# EasyEDA Pro project ProPrj_ProDoc_Board_AI8051U_20240829A_2024-08-30.epro, schematic Schematic_20240829A, sheets 1 to 2 of 6

## Sheets
1 P1: Board Name: Board_20240829A; Drawed: www.STCAI.com; Reviewed: RHYS; Version: V1.2.2
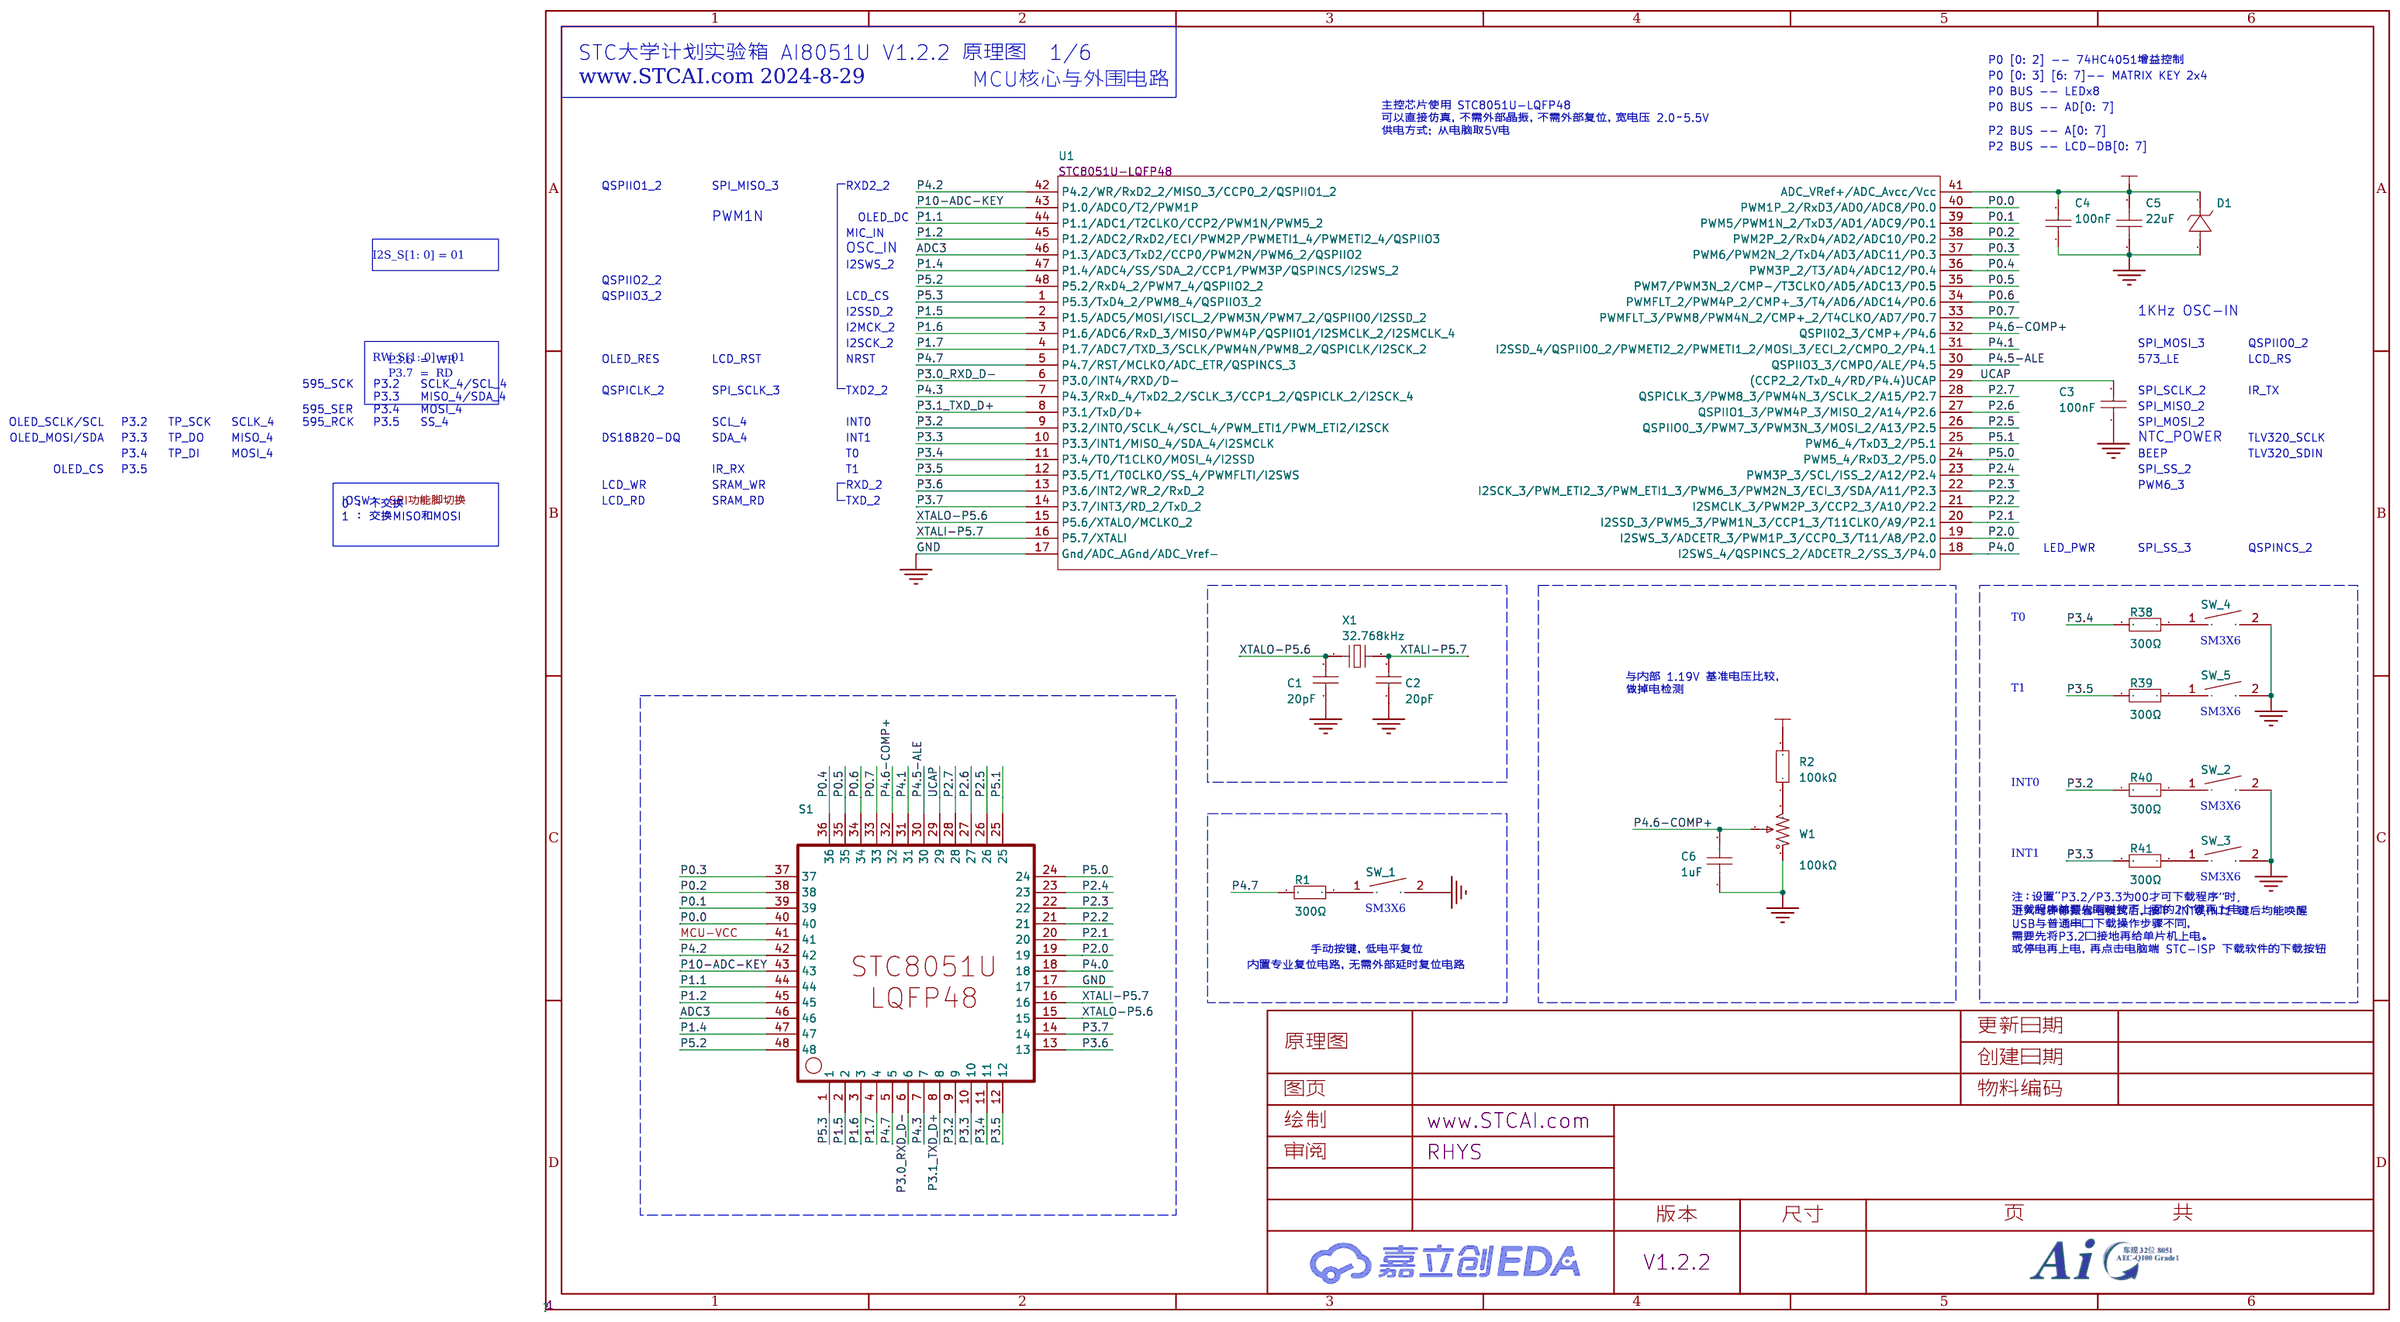
[diagram p0: P1]
2 P2
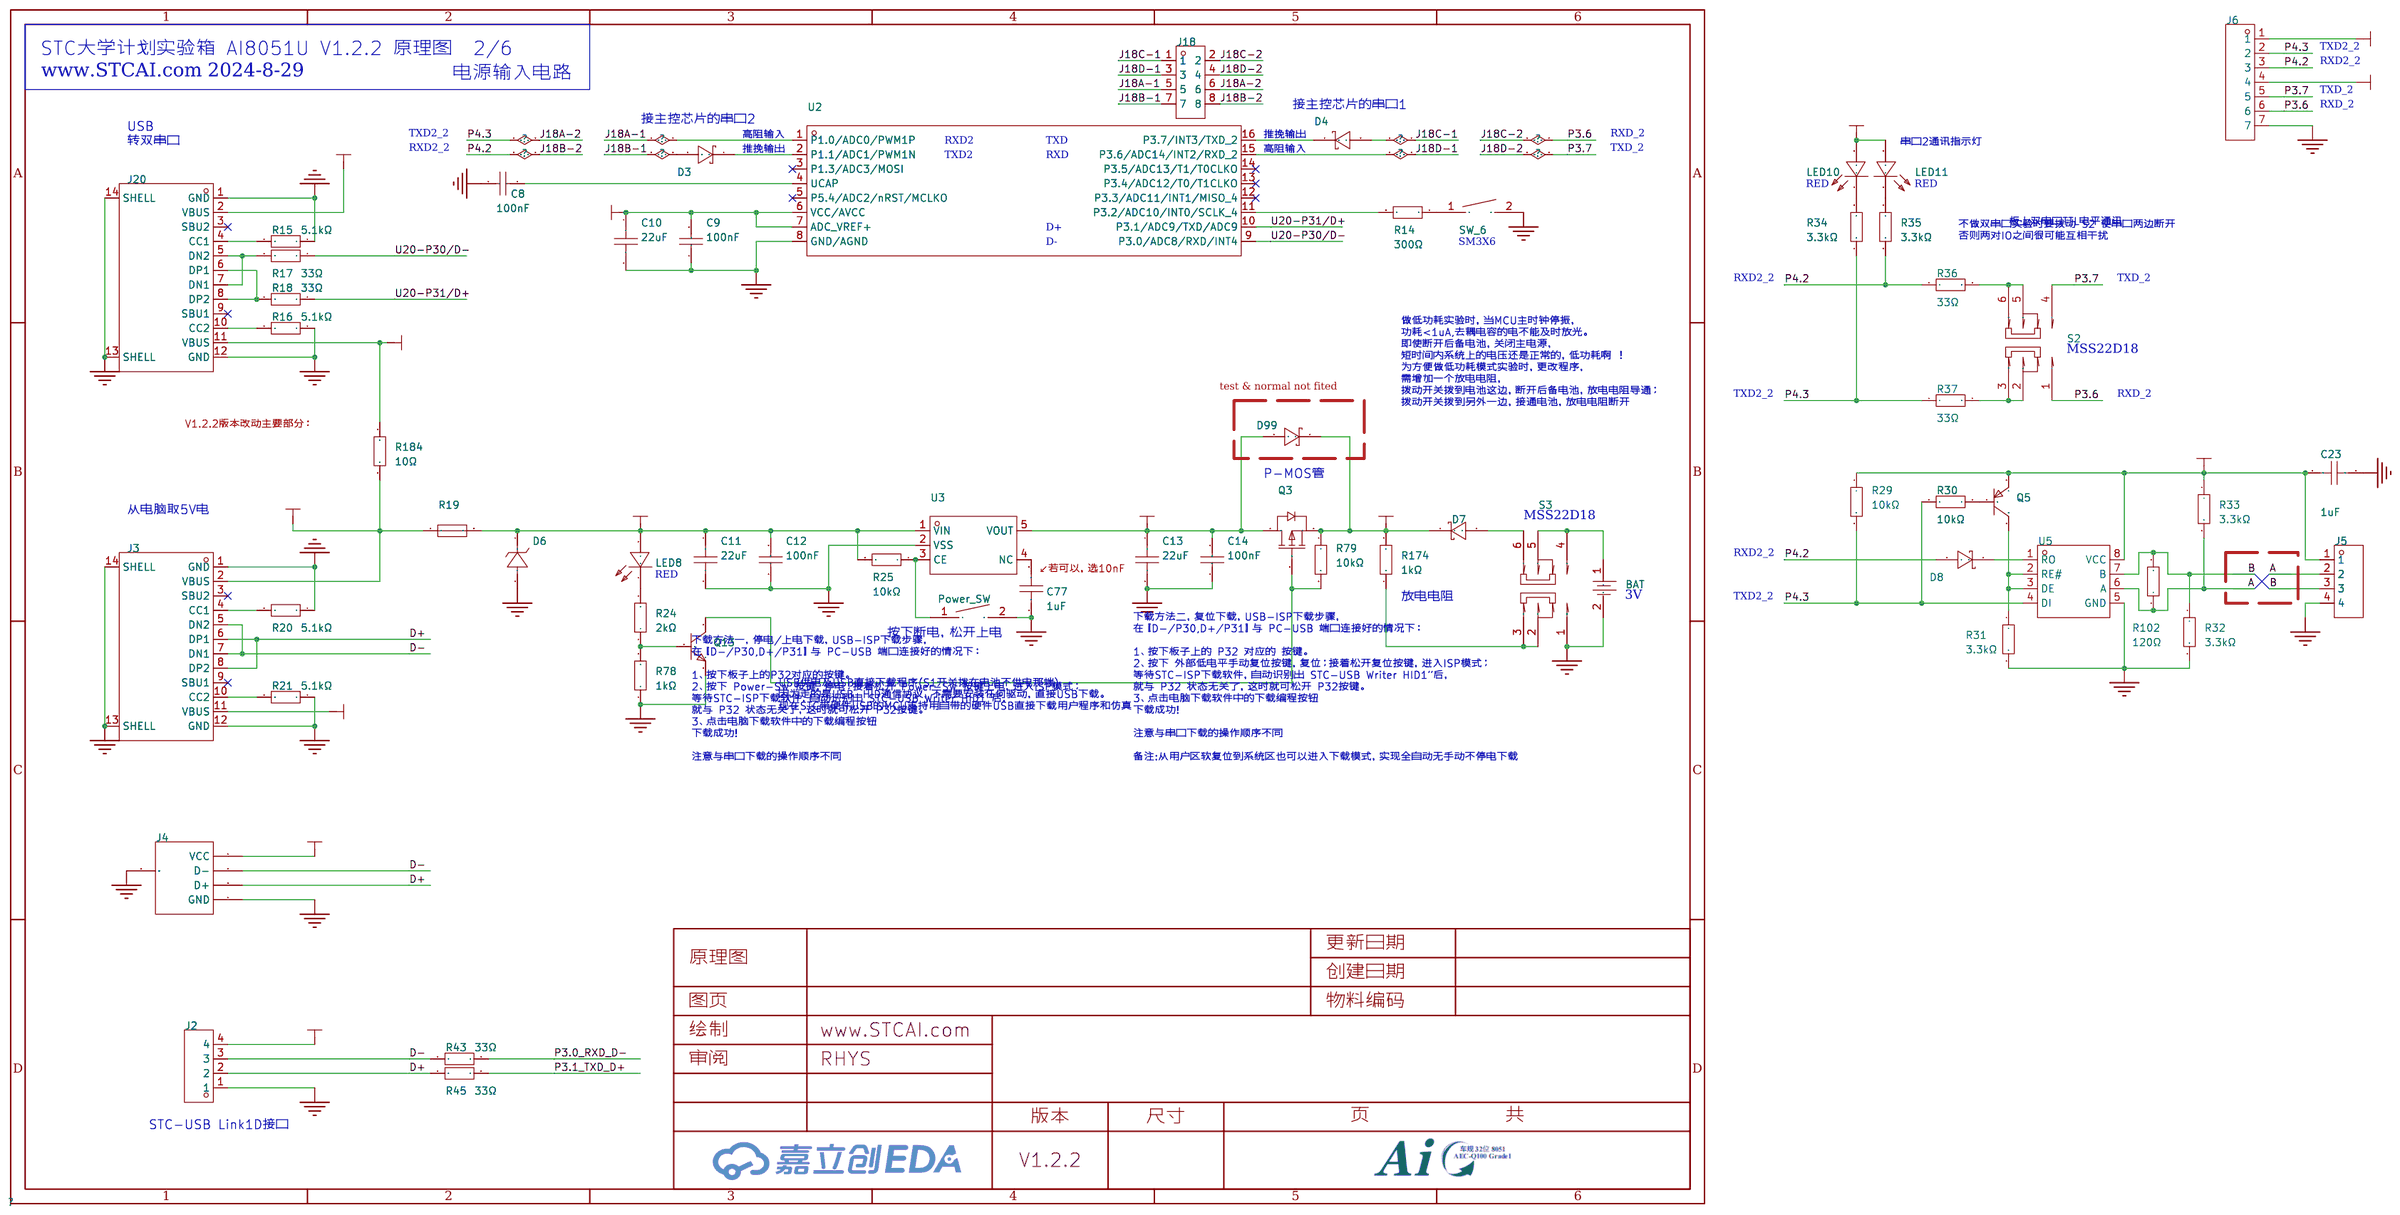
[diagram p1: P2]

## Parts
sheet P1
C1  20pF  [C0603]
C2  20pF  [C0603]
C3  100nF  [C0603]
C4  100nF  [C0603]
C5  22uF  [C0603]
C6  1uF  [C0603]
D1  SMBJ5338B  [SMB_L4.6-W3.6-LS5.4-RD]
R1  300Ω  [R0603]
R2  100kΩ  [R0603]
R38  300Ω  [R0603]
R39  300Ω  [R0603]
R40  300Ω  [R0603]
R41  300Ω  [R0603]
S1  -  [FP_LQFP-48-MiniCore]
SW_1  TSA363G25-250B  [SW-SMD_L6.1-W3.6-LS8.0]
SW_2  TSA363G25-250B  [SW-SMD_L6.1-W3.6-LS8.0]
SW_3  TSA363G25-250B  [SW-SMD_L6.1-W3.6-LS8.0]
SW_4  TSA363G25-250B  [SW-SMD_L6.1-W3.6-LS8.0]
SW_5  TSA363G25-250B  [SW-SMD_L6.1-W3.6-LS8.0]
U1  STC8051U  [LQFP-48_48P-L7.0-W7.0-P0.50-LS9.0-BL]
W1  100kΩ  [RES-ADJ-TH_3362P]
X1  32.768kHz  [OSC-SMD_L3.2-W1.5]
sheet P2
BAT  KH-CR1220-2  [BAT-SMD_CR1220-2]
C8  100nF  [C0603]
C9  100nF  [C0603]
C10  22uF  [C0603]
C11  22uF  [C0603]
C12  100nF  [C0603]
C13  22uF  [C0603]
C14  100nF  [C0603]
C23  1uF  [C0603]
C77  1uF  [C0603]
D3  1N5817WS  [SOD-323_L1.8-W1.3-LS2.5-RD]
D4  1N5817WS  [SOD-323_L1.8-W1.3-LS2.5-RD]
D6  SMBJ5338B  [SMB_L4.6-W3.6-LS5.4-RD]
D7  1N5817WS  [SOD-323_L1.8-W1.3-LS2.5-RD]
D8  1N5817WS  [SOD-323_L1.8-W1.3-LS2.5-RD]
D99  1N5817WS  [SOD-323_L1.8-W1.3-LS2.5-RD]
J2  BX-XH2.54-4PZZ  [CONN-TH_4P-P2.50_BX-XH2.54-4PZZ]
J3  TYPE-C 16PIN 2MD(073)  [USB-C-SMD_TYPE-C-6PIN-2MD-073]
J4  AF 90° WJDG  [USB-A-TH_AF-WJDG]
J5  BX-XH2.54-4PZZ  [CONN-TH_4P-P2.50_BX-XH2.54-4PZZ]
J6  BX-HA2.54-7PZZ  [CONN-TH_7P-P2.50_BX-HA2.54-7PZZ]
J18  2.54-2*4P立贴针  [HDR-SMD_8P-P2.54-V-M-R2-C4-LS7.4]
J20  TYPE-C 16PIN 2MD(073)  [USB-C-SMD_TYPE-C-6PIN-2MD-073]
LED8  KT-0603R  [LED0603-RD]
LED10  KT-0603R  [LED0603-RD]
LED11  KT-0603R  [LED0603-RD]
Power_SW  TSA363G25-250B  [SW-SMD_L6.1-W3.6-LS8.0]
Q3  AO3401A  [SOT-23_L2.9-W1.3-P1.90-LS2.4-BR]
Q5  SS8550 Y2  [SOT-23-3_L2.9-W1.3-P1.90-LS2.4-BR]
Q13  SS8050  [SOT-23-3_L2.9-W1.3-P1.90-LS2.4-BR]
R14  300Ω  [R0603]
R15  5.1kΩ  [R0603]
R16  5.1kΩ  [R0603]
R17  33Ω  [R0603]
R18  33Ω  [R0603]
R19  SMD0805B050TF  [F0805]
R20  5.1kΩ  [R0603]
R21  5.1kΩ  [R0603]
R24  2kΩ  [R0603]
R25  10kΩ  [R0603]
R29  10kΩ  [R0603]
R30  10kΩ  [R0603]
R31  3.3kΩ  [R0603]
R32  3.3kΩ  [R0603]
R33  3.3kΩ  [R0603]
R34  3.3kΩ  [R0603]
R35  3.3kΩ  [R0603]
R36  33Ω  [R0603]
R37  33Ω  [R0603]
R43  33Ω  [R0603]
R45  33Ω  [R0603]
R78  1kΩ  [R0603]
R79  10kΩ  [R0603]
R102  120Ω  [R0603]
R174  1kΩ  [R0603]
R184  10Ω  [R0603]
S2  SS-3235S-L1  [SW-SMD_SS-3235S-LX]
S3  SS-3235S-L1  [SW-SMD_SS-3235S-LX]
SW_6  TSA363G25-250B  [SW-SMD_L6.1-W3.6-LS8.0]
U2  STC8H2K12U-45I-SOP16  [SOP-16_L9.9-W3.9-P1.27-LS6.0-BL]
U3  ME6213C33M5G  [SOT-23-5_L3.0-W1.7-P0.95-LS2.8-BR]
U5  SP3485EN-L/TR  [SOIC-8_L5.0-W4.0-P1.27-LS6.0-BL]

## Library data of the parts
C1 C2 = CC0603JRNPO9BN200: 容值:20pF;精度:±5%;额定电压:50V;材质(温度系数):NP0;; LCSC Part Name: 20pF ±5% 50V; Supplier Part: C105621; Manufacturer: YAGEO(国巨); Supplier Footprint: 0603; JLCPCB Part Class: 扩展库; Datasheet: https://atta.szlcsc.com/upload/public/pdf/source/20170505/1493957838062.pdf; Supplier: LCSC; Tolerance: ±5%; Voltage Rated: 50V; Temperature Coefficient: NP0
C3 C4 C8 C9 C12 C14 = CL10B104KO8NNNC: 容值:100nF;精度:±10%;额定电压:16V;材质(温度系数):X7R;; LCSC Part Name: 100nF ±10% 16V; Supplier Part: C66501; Manufacturer: SAMSUNG(三星); Supplier Footprint: 0603; JLCPCB Part Class: 扩展库; Datasheet: https://atta.szlcsc.com/upload/public/pdf/source/20160218/1457707763339.pdf; Supplier: LCSC; Tolerance: ±10%; Voltage Rated: 16V; Temperature Coefficient: X7R
C5 C10 C11 C13 = CL10A226MO7JZNC: 容值:22uF;精度:±20%;额定电压:16V;材质(温度系数):X5R;; LCSC Part Name: 22uF ±20% 16V; Supplier Part: C2762594; Manufacturer: SAMSUNG(三星); Supplier Footprint: 0603; JLCPCB Part Class: 扩展库; Datasheet: https://atta.szlcsc.com/upload/public/pdf/source/20220811/0832C3B1C642040B023B7A6186895861.pdf; Supplier: LCSC; Tolerance: ±20%; Voltage Rated: 16V; Temperature Coefficient: X5R
C6 C23 C77 = CL10A105KB8NNNC: 容值:1uF;精度:±10%;额定电压:50V;材质(温度系数):X5R;; LCSC Part Name: 1uF ±10% 50V; Supplier Part: C15849; Manufacturer: SAMSUNG(三星); Supplier Footprint: 0603; Datasheet: https://atta.szlcsc.com/upload/public/pdf/source/20160218/1457707763339.pdf; Supplier: LCSC; Tolerance: ±10%; Voltage Rated: 50V; Temperature Coefficient: X5R
D1 D6 = SMBJ5338B_C19077493: 二极管配置:独立式;稳压值(标称值):5.1V;稳压值(范围):4.85V~5.36V;功率:5W;; Supplier Part: C19077493; Manufacturer: 宏迦橙; Supplier Footprint: SMB; Datasheet: https://atta.szlcsc.com/upload/public/pdf/source/20231024/356C06B1F951B7783177D5E20F04BB62.pdf; Supplier: LCSC; Diode Configuration: 独立式; Zener Voltage (Nom): 5.1V; Reverse Leakage Current (Ir): 1uA@1V; Zener Voltage (Range): 4.85V~5.36V; Power Dissipation: 5W; Zener Impedance (Zzt): 1.5Ω
R1 R14 R38-R41 = 0603WAF3000T5E: 电阻类型:厚膜电阻;阻值:300Ω;精度:±1%;功率:100mW;最大工作电压:75V;温度系数:±100ppm/℃;; LCSC Part Name: 300Ω ±1% 100mW 厚膜电阻; Supplier Part: C23025; Manufacturer: UNI-ROYAL(厚声); Supplier Footprint: 0603; JLCPCB Part Class: 基础库; Datasheet: https://atta.szlcsc.com/upload/public/pdf/source/20200306/C422600_1E6D84923E4A46A82E41ADD87F860B5C.pdf; Supplier: LCSC; Type: 厚膜电阻; Tolerance: ±1%; Power(Watts): 100mW; Overload Voltage (Max): 75V; Temperature Coefficient: ±100ppm/℃; Operating Temperature Range: -55℃~+155℃
R2 = 0603WAF1003T5E: 电阻类型:厚膜电阻;阻值:100kΩ;精度:±1%;功率:100mW;最大工作电压:75V;温度系数:±100ppm/℃;; LCSC Part Name: 100kΩ ±1% 100mW 厚膜电阻; Supplier Part: C25803; Manufacturer: UNI-ROYAL(厚声); Supplier Footprint: 0603; JLCPCB Part Class: 基础库; Datasheet: https://atta.szlcsc.com/upload/public/pdf/source/20200306/C422600_1E6D84923E4A46A82E41ADD87F860B5C.pdf; Supplier: LCSC; Type: 厚膜电阻; Tolerance: ±1%; Power(Watts): 100mW; Overload Voltage (Max): 75V; Temperature Coefficient: ±100ppm/℃; Operating Temperature Range: -55℃~+155℃
S1 = LQFP48-MiniCore
Power_SW SW_1-SW_6 = TSA363G25-250B: 电路结构:单刀单掷;按钮形状:矩形按钮;作用力:250gf;安装方式:立贴;开关长度:6.05mm;开关宽度:3.6mm;开关高度:2.5mm;带支架:不带;触点电流:50mA;额定电压(DC):12V;绝缘电阻:100MΩ;带灯:无;机械寿命:5万次;; LCSC Part Name: 6.05*3.6*2.5mm 立贴 轻触开关; Supplier Part: C354943; Manufacturer: BRIGHT(博瑞泰); Supplier Footprint: SMD; JLCPCB Part Class: 扩展库; Datasheet: https://atta.szlcsc.com/upload/public/pdf/source/20190426/C354943_F8D02988919B0D3B4D493E3C3D798834.pdf; Supplier: LCSC; Circuit: 单刀单掷; Actuator Style: 矩形按钮; Operating Force: 250gf; Mounting Style: 立贴; Switch Length: 6.05mm; Switch Width: 3.6mm; Switch Height: 2.5mm; Strike Gundam: 不带; Contact Current: 50mA; Voltage Rating (DC): 12V; Insulation Resistance: 100MΩ; Actuator/Cap Color: 白色; With Lamp: 无; Pin Style: 鸥翼型; Mechanical Life: 5万次; Operating Temperature: -25℃~+70℃
U1 = STC8051U: STC8051U-LQFP48
W1 = 3362P-1-104: 阻值:100kΩ;精度:±10%;; LCSC Part Name: 100kΩ ±10%; Supplier Part: C118966; Manufacturer: BOCHEN(博晨); Supplier Footprint: 插件; JLCPCB Part Class: 扩展库; Datasheet: https://atta.szlcsc.com/upload/public/pdf/source/20171114/C118966_15106326666201117452.pdf; Supplier: LCSC; Tolerance: ±10%
X1 = X321532768KGD2SI: 晶振类型:贴片晶振;频率:32.768kHz;常温频差:±20ppm;外接负载电容:12.5pF;频率稳定度(全温):-;; LCSC Part Name: 32.768kHz ±20ppm 12.5pF; Supplier Part: C620155; Manufacturer: YXC(扬兴晶振); Supplier Footprint: SMD3215-2P; JLCPCB Part Class: 扩展库; Datasheet: https://atta.szlcsc.com/upload/public/pdf/source/20240329/3A7650FD985DD0DE85694D3785AB4916.pdf; Supplier: LCSC; Crystal Type: 贴片晶振; Normal temperature Frequency Tolerance: ±20ppm; External load capacitor: 12.5pF; Operating Temperature: -40℃~+85℃
BAT = KH-CR1220-2: PPS BS-1220-2贴片正负极带孔6号模; Supplier Part: C5365933; Manufacturer: kinghelm(金航标); JLCPCB Part Class: 扩展库; Datasheet: https://atta.szlcsc.com/upload/public/pdf/source/20230301/1E62885793E6CFB75C333AA3D0BD606A.pdf; Supplier: LCSC
D3 D4 D7 D8 D99 = 1N5817WS: 正向压降(Vf):750mV@3.1A;直流反向耐压(Vr):20V;平均整流电流(Io):1A;; LCSC Part Name: 电压:20V 电流:1A; Supplier Part: C489146; Manufacturer: KEXIN(科信); Supplier Footprint: SOD-323; JLCPCB Part Class: 扩展库; Datasheet: https://atta.szlcsc.com/upload/public/pdf/source/20200225/C489147_F0861A42A5EB259406EDAA7C68BCB597.pdf; Supplier: LCSC; Forward Voltage (Vf@If): 750mV@3.1A; Reverse Voltage (Vr): 20V; Average Rectified Current (Io): 1A
J2 J5 = BX-XH2.54-4PZZ: 插针结构:1x4P;间距:2.54mm;安装方式:直插;参考系列:XH;总PIN数:4P;排数:1;每排PIN数:4;行距:-;额定电流:3A;触头材质:黄铜;触头镀层:锡;工作温度范围:-25℃~+85℃;; Supplier Part: C18077835; Manufacturer: Bossie(博锡); Supplier Footprint: 插件,P=2.54mm; JLCPCB Part Class: 扩展库; Datasheet: https://atta.szlcsc.com/upload/public/pdf/source/20231017/5821079C87ACB6AB664C681F6F628D03.pdf; Supplier: LCSC; Pins Structure: 1x4P; Pitch: 2.54mm; Mounting Style: 直插; Reference Series: XH; Number of Pins: 4P; Number of Rows: 1; Number of PINs Per Row: 4; Current Rating (Max): 3A; Contact Material: 黄铜; Contact Plating: 锡; Operating Temperature Range: -25℃~+85℃
J3 J20 = TYPE-C 16PIN 2MD(073): 连接器类型:Type-C;标准:-;公母:母;端口数量:1;触点数量:16P;安装方式:卧贴;额定电流 - 电源:5A;工作温度范围:-25℃~+85℃;; LCSC Part Name: Type-C 母 卧贴; Supplier Part: C2765186; Manufacturer: SHOU HAN(首韩); Supplier Footprint: SMD; JLCPCB Part Class: 扩展库; Datasheet: https://atta.szlcsc.com/upload/public/pdf/source/20211123/39B17C16241EAC15C5E277BDA434118E.pdf; Supplier: LCSC; Connector Type: Type-C; Gender: 母; Number of Ports: 1; Number of Contacts: 16P; Mounting Style: 卧贴; Current Rating - Power (Max): 5A; Operating Temperature Range: -25℃~+85℃
J4 = AF 90° WJDG: 连接器类型:Type-A;标准:USB 2.0;公母:母;端口数量:1;触点数量:4P;安装方式:弯插;额定电流 - 电源:1.5A;工作温度范围:-25℃~+85℃;; LCSC Part Name: Type-A 母 弯插; Supplier Part: C456018; Manufacturer: SHOU HAN(首韩); Supplier Footprint: 插件; JLCPCB Part Class: 扩展库; Datasheet: https://atta.szlcsc.com/upload/public/pdf/source/20191113/C456018_B104E062BEB8E11E57E63560E04EE13A.pdf; Supplier: LCSC; Connector Type: Type-A; Standard: USB 2.0; Gender: 母; Number of Ports: 1; Number of Contacts: 4P; Mounting Style: 弯插; Current Rating - Power (Max): 1.5A; Operating Temperature Range: -25℃~+85℃
J6 = BX-HA2.54-7PZZ: 插针结构:1x7P;间距:2.54mm;安装方式:直插;参考系列:-;总PIN数:7P;排数:1;每排PIN数:7;行距:-;额定电流:3A;触头材质:黄铜;触头镀层:锡;工作温度范围:-25℃~+85℃;; LCSC Part Name: 1x7P 间距:2.54mm 直插; Supplier Part: C18077820; Manufacturer: Bossie(博锡); Supplier Footprint: 插件,P=2.54mm; Datasheet: https://atta.szlcsc.com/upload/public/pdf/source/20231017/A4DEDB2B134730F88A4902D1943B965C.pdf; Supplier: LCSC; Pins Structure: 1x7P; Pitch: 2.54mm; Mounting Style: 直插; Number of Pins: 7P; Number of Rows: 1; Number of PINs Per Row: 7; Current Rating (Max): 3A; Contact Material: 黄铜; Contact Plating: 锡; Operating Temperature Range: -25℃~+85℃
J18 = 2.54-2*4P立贴针: 插针结构:2x4P;间距:2.54mm;行距:2.54mm;圆针/方针:方针;安装类型:立贴;排数:双排;总PIN位数:8P;额定电流:3A;额定电压:-;配合针长度:6mm;塑高:2.5mm;端接针长度:-;触头材质:-;触头镀层:-;工作温度范围:-55℃~+105℃;颜色:黑色;; LCSC Part Name: 间距:2.54mm 2x4P 立贴 方针; Supplier Part: C192300; Manufacturer: BOOMELE(博穆精密); Supplier Footprint: SMD,P=2.54mm; JLCPCB Part Class: 扩展库; Datasheet: https://atta.szlcsc.com/upload/public/pdf/source/20210812/F9D0E068B6990BF98BEA9D68FBD6ED36.pdf; Supplier: LCSC; Pin Structure: 2x4P; Pitch: 2.54mm; Row Spacing: 2.54mm; Circluar Pins/Square Pins: 方针; Mounting Type: 立贴; Number of Rows: 双排; Number of Pins: 8P; Current Rating (Max): 3A; Length of Mating Pin: 6mm; Insulation Height: 2.5mm; Operating Temperature Range: -55℃~+105℃; Color: 黑色
LED8 LED10 LED11 = KT-0603R: 发光颜色:红色;功率:-;正向电流:-;主波长:-;二极管配置:-;透镜颜色:-;色温:-;发光角度:-;载带方式:-;工作温度:-40℃~+85℃;; LCSC Part Name: 0603 红灯 高亮; Supplier Part: C2286; Manufacturer: KENTO; Supplier Footprint: 0603; JLCPCB Part Class: 基础库; Datasheet: https://atta.szlcsc.com/upload/public/pdf/source/20160616/1466072038404.pdf; Supplier: LCSC; Emitted Color: 红色; Operating Temperature: -40℃~+85℃
Q3 = AO3401A_C15127: 类型:1个P沟道;漏源电压(Vdss):30V;连续漏极电流(Id):4A;功率(Pd):1.4W;导通电阻(RDS(on)@Vgs,Id):44mΩ@10V,4.3A;阈值电压(Vgs(th)@Id):1.3V@250uA;; LCSC Part Name: 1个P沟道 耐压:30V 电流:4A; Supplier Part: C15127; Manufacturer: AOS; Supplier Footprint: SOT-23; JLCPCB Part Class: 基础库; Datasheet: https://atta.szlcsc.com/upload/public/pdf/source/20160507/1462613609053.pdf; Supplier: LCSC; Type: 1个P沟道; Drain Source Voltage (Vdss): 30V; Continuous Drain Current (Id): 4A; Power Dissipation (Pd): 1.4W; Drain Source On Resistance (RDS(on)@Vgs,Id): 44mΩ@10V,4.3A; Gate Threshold Voltage (Vgs(th)@Id): 1.3V@250uA; Total Gate Charge (Qg@Vgs): 12.2nC@4.5V; Input Capacitance (Ciss@Vds): 1.2nF@15V; Operating Temperature: -55℃~+150℃@(Tj)
Q5 = SS8550 Y2: 晶体管类型:PNP;集电极电流(Ic):1.5A;集射极击穿电压(Vceo):25V;功率(Pd):300mW;直流电流增益(hFE@Ic,Vce):200@100mA,1V;; LCSC Part Name: SS8550 Y2(RANGE:200-350) hfe=200~350; Supplier Part: C8542; Manufacturer: CJ(江苏长电/长晶); Supplier Footprint: SOT-23; JLCPCB Part Class: 基础库; Datasheet: https://atta.szlcsc.com/upload/public/pdf/source/20140809/1457707214734.pdf; Supplier: LCSC; Transistor Type: PNP; Collector Current (Ic): 1.5A; Collector-Emitter Breakdown Voltage (Vceo): 25V; Power Dissipation (Pd): 300mW; DC Current Gain (hFE@Ic,Vce): 200@100mA,1V; Transition Frequency (fT): 100MHz; Collector Cut-Off Current (Icbo): 100nA; Collector-Emitter Saturation Voltage (VCE(sat)@Ic,Ib): 500mV@800mA,80mA
Q13 = SS8050_C2150: 晶体管类型:NPN;集电极电流(Ic):1.5A;集射极击穿电压(Vceo):25V;功率(Pd):300mW;直流电流增益(hFE@Ic,Vce):200@100mA,1V;; LCSC Part Name: SS8050(RANGE:200-350) hfe=200~350; Supplier Part: C2150; Manufacturer: CJ(江苏长电/长晶); Supplier Footprint: SOT-23; JLCPCB Part Class: 基础库; Datasheet: https://atta.szlcsc.com/upload/public/pdf/source/20230322/AEE86F4B043774EFF80CAEA14A37D9E9.pdf; Supplier: LCSC; Transistor Type: NPN; Collector Current (Ic): 1.5A; Collector-Emitter Breakdown Voltage (Vceo): 25V; Power Dissipation (Pd): 300mW; DC Current Gain (hFE@Ic,Vce): 200@100mA,1V; Transition Frequency (fT): 100MHz; Collector Cut-Off Current (Icbo): 100nA; Collector-Emitter Saturation Voltage (VCE(sat)@Ic,Ib): 500mV@800mA,80mA
R15 R16 R20 R21 = 0603WAF5101T5E: 电阻类型:厚膜电阻;阻值:5.1kΩ;精度:±1%;功率:100mW;最大工作电压:75V;温度系数:±100ppm/℃;; LCSC Part Name: 5.1kΩ ±1% 100mW 厚膜电阻; Supplier Part: C23186; Manufacturer: UNI-ROYAL(厚声); Supplier Footprint: 0603; Datasheet: https://atta.szlcsc.com/upload/public/pdf/source/20200306/C422600_1E6D84923E4A46A82E41ADD87F860B5C.pdf; Supplier: LCSC; Type: 厚膜电阻; Tolerance: ±1%; Power(Watts): 100mW; Overload Voltage (Max): 75V; Temperature Coefficient: ±100ppm/℃; Operating Temperature Range: -55℃~+155℃
R17 R18 R36 R37 R43 R45 = 0603WAF330JT5E: 电阻类型:厚膜电阻;阻值:33Ω;精度:±1%;功率:100mW;最大工作电压:75V;温度系数:±100ppm/℃;; LCSC Part Name: 33Ω ±1% 100mW 厚膜电阻; Supplier Part: C23140; Manufacturer: UNI-ROYAL(厚声); Supplier Footprint: 0603; Datasheet: https://atta.szlcsc.com/upload/public/pdf/source/20200306/C422600_1E6D84923E4A46A82E41ADD87F860B5C.pdf; Supplier: LCSC; Type: 厚膜电阻; Tolerance: ±1%; Power(Watts): 100mW; Overload Voltage (Max): 75V; Temperature Coefficient: ±100ppm/℃; Operating Temperature Range: -55℃~+155℃
R19 = SMD0805B050TF: 最大电压:6V;最大电流:100A;保持电流:500mA;跳闸电流:1A;; LCSC Part Name: 6V 500mA 0805自恢复; Supplier Part: C269104; Manufacturer: Brightking(君耀电子); Supplier Footprint: 0805; JLCPCB Part Class: 扩展库; Datasheet: https://atta.szlcsc.com/upload/public/pdf/source/20180913/C269107_1BF28CF6F4C5BFD5B8CD673BC8D2B923.pdf; Supplier: LCSC; Operating Voltage (Max): 6V; Current Rating (Max): 100A; Hold Current: 500mA; Trip Current: 1A; Resistance - Initial (Ri) (Min): 150mΩ; Maximum Time to Trip: 100ms; Operating Temperature: -40℃~+85℃；-40℃~+85℃；-40℃~+85℃
R24 = 0603WAF2001T5E: 电阻类型:厚膜电阻;阻值:2kΩ;精度:±1%;功率:100mW;最大工作电压:75V;温度系数:±100ppm/℃;; LCSC Part Name: 2kΩ ±1% 100mW 厚膜电阻; Supplier Part: C22975; Manufacturer: UNI-ROYAL(厚声); Supplier Footprint: 0603; JLCPCB Part Class: 基础库; Datasheet: https://atta.szlcsc.com/upload/public/pdf/source/20200306/C422600_1E6D84923E4A46A82E41ADD87F860B5C.pdf; Supplier: LCSC; Type: 厚膜电阻; Tolerance: ±1%; Power(Watts): 100mW; Overload Voltage (Max): 75V; Temperature Coefficient: ±100ppm/℃; Operating Temperature Range: -55℃~+155℃
R25 R29 R30 R79 = 0603WAF1002T5E: 电阻类型:厚膜电阻;阻值:10kΩ;精度:±1%;功率:100mW;最大工作电压:75V;温度系数:±100ppm/℃;; LCSC Part Name: 厚膜电阻 10kΩ ±1% 100mW; Supplier Part: C25804; Manufacturer: UNI-ROYAL(厚声); Supplier Footprint: 0603; JLCPCB Part Class: 基础库; Datasheet: https://atta.szlcsc.com/upload/public/pdf/source/20200306/C422600_1E6D84923E4A46A82E41ADD87F860B5C.pdf; Supplier: LCSC; Type: 厚膜电阻; Tolerance: ±1%; Power(Watts): 100mW; Overload Voltage (Max): 75V; Temperature Coefficient: ±100ppm/℃; Operating Temperature Range: -55℃~+155℃
R31-R35 = 0603WAF3301T5E: 电阻类型:厚膜电阻;阻值:3.3kΩ;精度:±1%;功率:100mW;最大工作电压:75V;温度系数:±100ppm/℃;; LCSC Part Name: 3.3kΩ ±1% 100mW 厚膜电阻; Supplier Part: C22978; Manufacturer: UNI-ROYAL(厚声); Supplier Footprint: 0603; JLCPCB Part Class: 基础库; Datasheet: https://atta.szlcsc.com/upload/public/pdf/source/20200306/C422600_1E6D84923E4A46A82E41ADD87F860B5C.pdf; Supplier: LCSC; Type: 厚膜电阻; Tolerance: ±1%; Power(Watts): 100mW; Overload Voltage (Max): 75V; Temperature Coefficient: ±100ppm/℃; Operating Temperature Range: -55℃~+155℃
R78 R174 = 0603WAF1001T5E: 电阻类型:厚膜电阻;阻值:1kΩ;精度:±1%;功率:100mW;最大工作电压:75V;温度系数:±100ppm/℃;; LCSC Part Name: 1kΩ ±1% 100mW 厚膜电阻; Supplier Part: C21190; Manufacturer: UNI-ROYAL(厚声); Supplier Footprint: 0603; JLCPCB Part Class: 基础库; Datasheet: https://atta.szlcsc.com/upload/public/pdf/source/20200306/C422600_1E6D84923E4A46A82E41ADD87F860B5C.pdf; Supplier: LCSC; Type: 厚膜电阻; Tolerance: ±1%; Power(Watts): 100mW; Overload Voltage (Max): 75V; Temperature Coefficient: ±100ppm/℃; Operating Temperature Range: -55℃~+155℃
R102 = 0603WAF1200T5E: 电阻类型:厚膜电阻;阻值:120Ω;精度:±1%;功率:100mW;最大工作电压:75V;温度系数:±100ppm/℃;; LCSC Part Name: 120Ω ±1% 100mW 厚膜电阻; Supplier Part: C22787; Manufacturer: UNI-ROYAL(厚声); Supplier Footprint: 0603; Datasheet: https://atta.szlcsc.com/upload/public/pdf/source/20200306/C422600_1E6D84923E4A46A82E41ADD87F860B5C.pdf; Supplier: LCSC; Type: 厚膜电阻; Tolerance: ±1%; Power(Watts): 100mW; Overload Voltage (Max): 75V; Temperature Coefficient: ±100ppm/℃; Operating Temperature Range: -55℃~+155℃
R184 = 0603WAF100JT5E: 电阻类型:厚膜电阻;阻值:10Ω;精度:±1%;功率:100mW;最大工作电压:75V;温度系数:±400ppm/℃;; LCSC Part Name: 10Ω ±1% 100mW 厚膜电阻; Supplier Part: C22859; Manufacturer: UNI-ROYAL(厚声); Supplier Footprint: 0603; Datasheet: https://atta.szlcsc.com/upload/public/pdf/source/20200306/C422600_1E6D84923E4A46A82E41ADD87F860B5C.pdf; Supplier: LCSC; Type: 厚膜电阻; Tolerance: ±1%; Power(Watts): 100mW; Overload Voltage (Max): 75V; Temperature Coefficient: ±400ppm/℃; Operating Temperature Range: -55℃~+155℃
S2 S3 = SS-3235S-L1: 电路结构:双刀双掷;安装方式:卧贴;开关颜色:黑色;额定电流(DC):50mA;额定电压(DC):12V;额定电流(AC):50mA;额定电压(AC):12V;机械寿命:1万次;; LCSC Part Name: 柄长2mm 卧贴双档 滑动开关; Supplier Part: C500055; Manufacturer: XKB Connectivity(中国星坤); Supplier Footprint: SMD; JLCPCB Part Class: 扩展库; Datasheet: https://atta.szlcsc.com/upload/public/pdf/source/20211011/39D516E750C13BE9339464E723D9F132.pdf; Supplier: LCSC; Circuit: 双刀双掷; Actuator Style: 矩形柱状; Pin Style: 鸥翼型; Switch Length: 9.1mm; Switch Width: 3.55mm; Switch Height: 3.2mm; Mounting Style: 卧贴; Actuator Color: 黑色; Current Rating (DC): 50mA; Voltage Rating (DC): 12V; Current Rating (AC): 50mA; Voltage Rating (AC): 12V; Mechanical Life: 1万次; Operating Temperature: -40℃~+85℃
U2 = STC8H2K12U-45I-SOP16: LCSC Part Name: 宽电压/高速/高可靠/低功耗/强抗静电/较强抗干扰的新一代 8051 单片机; Manufacturer: STC(宏晶); Supplier Footprint: SOP-16; Datasheet: https://atta.szlcsc.com/upload/public/pdf/source/20240415/6EBDADF517194314A061D0AE8E2F25D8.pdf
U3 = ME6213C33M5G: 输出类型:固定;最大输入电压:6V;输出电压:3.3V;最大输出电流:350mA;电源纹波抑制比(PSRR):-;输出极性:正极;; LCSC Part Name: 输入6V 输出3.3V 350mA; Supplier Part: C236666; Manufacturer: MICRONE(南京微盟); Supplier Footprint: SOT-23-5; JLCPCB Part Class: 扩展库; Datasheet: https://atta.szlcsc.com/upload/public/pdf/source/20180709/C236667_CF9713D9711AB045882DB3B854E4D8EF.pdf; Supplier: LCSC; Output Type: 固定; Maximum Input Voltage: 6V; Output Voltage: 3.3V; MAX Output Current: 350mA; Dropout Voltage: 200mV@(200mA); Output Polarity: 正极; Number of Outputs: 1
U5 = SP3485EN-L/TR: 类型:收发器;数据速率:10Mbps;驱动器/接收器:1/1;; LCSC Part Name: 3.3V供电 10Mbps 收发器; Supplier Part: C8963; Manufacturer: MaxLinear(迈凌); Supplier Footprint: SOIC-8; JLCPCB Part Class: 基础库; Datasheet: https://atta.szlcsc.com/upload/public/pdf/source/20170601/1496285796963.pdf; Supplier: LCSC; Types: 收发器; Supply Voltage: 3.3V; Data Rate: 10Mbps; Driver/receiver: 1/1; Operating Temperature: -40℃~+85℃

## Nets
GND: BAT.2 C1.1 C2.1 C3.1 C4.1 C5.2 C6.1 C8.2 C9.1 C10.2 C11.2 C12.1 C13.2 C14.1 C23.1 C77.1 D1.2(A) D6.2(A) J2.1 J3.1(GND) J3.12(GND) J3.13(SHELL) J3.14(SHELL) J4.4(GND) J4.5(SHLD) J5.4 J6.7 J20.1(GND) J20.12(GND) J20.13(SHELL) J20.14(SHELL) Power_SW.2 Q13.2(E) R15.1 R16.1 R20.1 R21.1 R31.2 R32.2 R78.1 S1.17 S3.1 SW_1.2 SW_2.2 SW_3.2 SW_4.2 SW_5.2 SW_6.2 U1.17(Gnd/ADC_AGnd/ADC_Vref-) U2.8(GND/AGND) U3.2(VSS) U5.5(GND) W1.1 ; also on sheet 3 4 5 6
A: J5.2 R33.2 R102.1 U5.6(A)
ADC3: S1.46 U1.46(P1.3/ADC3/TxD2/CCP0/PWM2N/PWM6_2/QSPIIO2) ; also on sheet 6
B: J5.3 R32.1 R102.2 U5.7(B)
D+: J2.2 J3.6(DP1) J3.8(DP2) J4.3(D+) R45.2
D-: J2.3 J3.5(DN2) J3.7(DN1) J4.2(D-) R43.2
J1B-1: S1.22 U1.22(I2SCK_3/PWM_ETI2_3/PWM_ETI1_3/PWM6_3/PWM2N_3/ECI_3/SDA/A11/P2.3) ; also on sheet 3 4
J1C-1: S1.24 U1.24(PWM5_4/RxD3_2/P5.0) ; also on sheet 3 5
J18A-1: J18.5 U2.1(P1.0/ADC0/PWM1P)
J18A-2: J6.2 J18.6 R29.2 R30.1 R34.1 R37.1 S1.7 U1.7(P4.3/RxD_4/TxD2_2/SCLK_3/CCP1_2/QSPICLK_2/I2SCK_4) U5.4(DI) ; also on sheet 3
J18B-1: D3.2 J18.7
J18B-2: D8.2 J6.3 J18.8 R35.2 R36.1 S1.42 U1.42(P4.2/WR/RxD2_2/MISO_3/CCP0_2/QSPIIO1_2) ; also on sheet 3
J18C-1: D4.2 J18.1
J18C-2: J6.6 J18.2 S1.13 S2.1 U1.13(P3.6/INT2/WR_2/RxD_2) ; also on sheet 3 4
J18D-1: J18.3 U2.15(P3.6/ADC14/INT2/RXD_2)
J18D-2: J6.5 J18.4 S1.14 S2.4 U1.14(P3.7/INT3/RD_2/TxD_2) ; also on sheet 3 4
MCU-VCC: C4.2 C5.1 D1.1(K) D7.1 D99.1 Q3.2(S) R79.1 R174.2 S1.41 U1.41(ADC_VRef+/ADC_Avcc/Vcc)
P0.0: S1.40 U1.40(PWM1P_2/RxD3/AD0/ADC8/P0.0) ; also on sheet 3 6
P0.1: S1.39 U1.39(PWM5/PWM1N_2/TxD3/AD1/ADC9/P0.1) ; also on sheet 3 6
P0.2: S1.38 U1.38(PWM2P_2/RxD4/AD2/ADC10/P0.2) ; also on sheet 3 6
P0.3: S1.37 U1.37(PWM6/PWM2N_2/TxD4/AD3/ADC11/P0.3) ; also on sheet 3
P0.4: S1.36 U1.36(PWM3P_2/T3/AD4/ADC12/P0.4) ; also on sheet 3 4
P0.5: S1.35 U1.35(PWM7/PWM3N_2/CMP-/T3CLKO/AD5/ADC13/P0.5) ; also on sheet 3 4
P0.6: S1.34 U1.34(PWMFLT_2/PWM4P_2/CMP+_3/T4/AD6/ADC14/P0.6) ; also on sheet 3
P0.7: S1.33 U1.33(PWMFLT_3/PWM8/PWM4N_2/CMP+_2/T4CLKO/AD7/P0.7) ; also on sheet 3 6
P1.1: S1.44 U1.44(P1.1/ADC1/T2CLKO/CCP2/PWM1N/PWM5_2) ; also on sheet 4 6
P1.2: S1.45 U1.45(P1.2/ADC2/RxD2/ECI/PWM2P/PWMETI1_4/PWMETI2_4/QSPIIO3) ; also on sheet 5
P1.4: S1.47 U1.47(P1.4/ADC4/SS/SDA_2/CCP1/PWM3P/QSPINCS/I2SWS_2) ; also on sheet 4 5
P1.5: S1.2 U1.2(P1.5/ADC5/MOSI/ISCL_2/PWM3N/PWM7_2/QSPIIO0/I2SSD) ; also on sheet 4 5
P1.6: S1.3 U1.3(P1.6/ADC6/RxD_3/MISO/PWM4P/QSPIIO1/I2SMCLK_2/I2SMCLK_4) ; also on sheet 5
P1.7: S1.4 U1.4(P1.7/ADC7/TXD_3/SCLK/PWM4N/PWM8_2/QSPICLK/I2SCK_2) ; also on sheet 5
P2.0: S1.19 U1.19(I2SWS_3/ADCETR_3/PWM1P_3/CCP0_3/T11/A8/P2.0) ; also on sheet 3 4
P2.1: S1.20 U1.20(I2SSD_3/PWM5_3/PWM1N_3/CCP1_3/T11CLKO/A9/P2.1) ; also on sheet 3 4
P2.2: S1.21 U1.21(I2SMCLK_3/PWM2P_3/CCP2_3/A10/P2.2) ; also on sheet 3 4
P2.4: S1.23 U1.23(PWM3P_3/SCL/ISS_2/A12/P2.4) ; also on sheet 3 4
P2.5: S1.26 U1.26(QSPIIO0_3/PWM7_3/PWM3N_3/MOSI_2/A13/P2.5) ; also on sheet 3 4
P2.6: S1.27 U1.27(QSPIIO1_3/PWM4P_3/MISO_2/A14/P2.6) ; also on sheet 3 4
P2.7: S1.28 U1.28(QSPICLK_3/PWM8_3/PWM4N_3/SCLK_2/A15/P2.7) ; also on sheet 3 4
P3.0_RXD_D-: R43.1 S1.6 U1.6(P3.0/INT4/RXD/D-)
P3.1_TXD_D+: R45.1 S1.8 U1.8(P3.1/TxD/D+)
P3.2: R40.2 S1.9 U1.9(P3.2/INTO/SCLK_4/SCL_4/PWM_ETI1/PWM_ETI2/I2SCK) ; also on sheet 3 4
P3.3: R41.2 S1.10 U1.10(P3.3/INT1/MISO_4/SDA_4/I2SMCLK) ; also on sheet 3 4
P3.4: R38.2 S1.11 U1.11(P3.4/T0/T1CLKO/MOSI_4/I2SSD) ; also on sheet 3 4
P3.5: R39.2 S1.12 U1.12(P3.5/T1/T0CLKO/SS_4/PWMFLTI/I2SWS) ; also on sheet 3 4
P4.0: S1.18 U1.18(I2SWS_4/QSPINCS_2/ADCETR_2/SS_3/P4.0) ; also on sheet 3
P4.1: S1.31 U1.31(I2SSD_4/QSPIIO0_2/PWMETI2_2/PWMETI1_2/MOSI_3/ECI_2/CMPO_2/P4.1) ; also on sheet 3
P4.5-ALE: S1.30 U1.30(QSPIIO3_3/CMPO/ALE/P4.5) ; also on sheet 3 4
P4.6-COMP+: C6.2 S1.32 U1.32(QSPII02_3/CMP+/P4.6) W1.2
P4.7: R1.2 S1.5 U1.5(P4.7/RST/MCLKO/ADC_ETR/QSPINCS_3) ; also on sheet 4
P5.1: S1.25 U1.25(PWM6_4/TxD3_2/P5.1) ; also on sheet 5 6
P5.2: S1.48 U1.48(P5.2/RxD4_2/PWM7_4/QSPIIO2_2) ; also on sheet 3
P5.3: S1.1 U1.1(P5.3/TxD4_2/PWM8_4/QSPIIO3_2) ; also on sheet 3 4
P10-ADC-KEY: S1.43 U1.43(P1.0/ADCO/T2/PWM1P) ; also on sheet 3
PC1-USB+5V: J2.4 J3.2(VBUS) J3.11(VBUS) J4.1(VCC) R19.1 R184.1
PC2-USB+5V: J20.2(VBUS) J20.11(VBUS) R184.2
SYS-VCC: C9.2 C10.1 C13.1 C14.2 C23.2 D99.2 J5.1 J6.1 J6.4 LED10.2(A) LED11.2(A) Q3.3(D) Q5.2(E) R29.1 R33.1 U2.6(VCC/AVCC) U2.7(ADC_VREF+) U3.5(VOUT) U5.8(VCC) ; also on sheet 3 4 5 6
U20-P30/D-: R17.1 U2.9(P3.0/ADC8/RXD/INT4)
U20-P31/D+: R18.1 U2.10(P3.1/ADC9/TXD/ADC9)
UCAP: C3.2 S1.29 U1.29((CCP2_2/TxD_4/RD/P4.4)UCAP)
USB+5V: C11.1 C12.2 D6.1(K) LED8.2(A) R2.2 R19.2 R25.2 U3.1(VIN) ; also on sheet 3 4
XTALI-P5.7: C2.2 S1.16 U1.16(P5.7/XTALI) X1.2
XTALO-P5.6: C1.2 S1.15 U1.15(P5.6/XTALO/MCLKO_2) X1.1
$1N1345: R1.1 SW_1.1
$1N1484: R40.1 SW_2.1
$1N1590: R41.1 SW_3.1
$1N1798: R38.1 SW_4.1
$1N1805: R39.1 SW_5.1
$1N7565: R2.1 W1.3
$2N482: J20.4(CC1) R15.2
$2N484: J20.5(DN2) J20.7(DN1) R17.2
$2N489: J20.6(DP1) J20.8(DP2) R18.2
$2N493: J20.10(CC2) R16.2
$2N1080: D3.1 U2.2(P1.1/ADC1/PWM1N)
$2N1122: C8.1 U2.4(UCAP)
$2N1454: D4.1 U2.16(P3.7/INT3/TXD_2)
$2N2191: J3.10(CC2) R21.2
$2N2192: J3.4(CC1) R20.2
$2N2806: LED8.1(K) R24.2
$2N2882: Q13.1(B) R24.1 R78.2
$2N3224: Q3.1(G) Q13.3(C) R79.2
$2N3364: C77.2 U3.4(NC)
$2N3631: Power_SW.1 R25.1 U3.3(CE)
$2N4132: D7.2 S3.6
$2N4145: R174.1 S3.2 S3.3
$2N4223: BAT.1 S3.4 S3.5
$2N4655: LED10.1(K) R34.2
$2N4733: LED11.1(K) R35.1
$2N4872: R37.2 S2.2 S2.3
$2N4878: R36.2 S2.5 S2.6
$2N6420: Q5.3(C) R31.1 U5.2(RE#) U5.3(DE)
$2N6421: D8.1 U5.1(RO)
$2N6775: Q5.1(B) R30.2
$2N29253: R14.1 SW_6.1
$2N29287: R14.2 U2.11(P3.2/ADC10/INT0/SCLK_4)

Not connected (* = marked no-connect by the designer): J3 3(SBU2)* 9(SBU1)*; J20 3(SBU2)* 9(SBU1)*; U2 3(P1.3/ADC3/MOSI)* 5(P5.4/ADC2/nRST/MCLKO)* 12(P3.3/ADC11/INT1/MISO_4)* 13(P3.4/ADC12/T0/T1CLKO)* 14(P3.5/ADC13/T1/T0CLKO)*

## Notes on the sheets
sheet 1
- STC大学计划实验箱 AI8051U V1.2.2 原理图  1/6
- P0 [0: 2] -- 74HC4051增益控制
- www.STCAI.com
- 2024-8-29
- MCU核心与外围电路
- P0 [0: 3] [6: 7]-- MATRIX KEY 2x4
- P0 BUS -- LEDx8
- P0 BUS -- AD[0: 7]
- 主控芯片使用 STC8051U-LQFP48
  可以直接仿真，不需外部晶振，不需外部复位，宽电压 2.0～5.5V
  供电方式: 从电脑取5V电
- P2 BUS -- A[0: 7]
- P2 BUS -- LCD-DB[0: 7]
- QSPIIO1_2
- SPI_MISO_3
- RXD2_2
- PWM1N
- OLED_DC
- MIC_IN
- OSC_IN
- I2S_S[1: 0] = 01
- I2SWS_2
- QSPIIO2_2
- QSPIIO3_2
- LCD_CS
- I2MCK_2
- I2SSD_2
- 1KHz OSC-IN
- I2SCK_2
- SPI_MOSI_3
- QSPIIO0_2
- RW_S[1: 0] = 01
- OLED_RES
- LCD_RST
- NRST
- 573_LE
- LCD_RS
- P3.6  =  WR
  P3.7  =  RD
- QSPICLK_2
- SPI_SCLK_3
- TXD2_2
- SPI_SCLK_2
- IR_TX
- OLED_SCLK/SCL
- P3.2
- TP_SCK
- SCLK_4
- 595_SCK
  595_SER
  595_RCK
- P3.2
  P3.3
  P3.4
  P3.5
- SCLK_4/SCL_4
  MISO_4/SDA_4
  MOSI_4
  SS_4
- SCL_4
- INT0
- SPI_MISO_2
- SPI_MOSI_2
- OLED_MOSI/SDA
- P3.3
- TP_DO
- MISO_4
- DS18B20-DQ
- SDA_4
- INT1
- NTC_POWER
- TLV320_SCLK
- P3.4
- TP_DI
- MOSI_4
- T0
- BEEP
- TLV320_SDIN
- OLED_CS
- P3.5
- IR_RX
- T1
- SPI_SS_2
- LCD_WR
- SRAM_WR
- RXD_2
- PWM6_3
- IOSW：
- SPI功能脚切换
- LCD_RD
- SRAM_RD
- TXD_2
- 0 ： 不交换
  1 ： 交换MISO和MOSI
- LED_PWR
- SPI_SS_3
- QSPINCS_2
- T0
- SM3X6
- 与内部 1.19V 基准电压比较，
  做掉电检测
- T1
- SM3X6
- INT0
- SM3X6
- INT1
- SM3X6
- SM3X6
- 注：设置“P3.2/P3.3为00才可下载程序”时,
  下载程序前要先同时按下上面的2个键再上电
- 手动按键，低电平复位
- 进入时钟停振省电模式后，按下 INT0,INT1 键后均能唤醒
  USB与普通串口下载操作步骤不同，
  需要先将P3.2口接地再给单片机上电。
  或停电再上电，再点击电脑端 STC-ISP 下载软件的下载按钮
- 内置专业复位电路，无需外部延时复位电路
sheet 2
- STC大学计划实验箱 AI8051U V1.2.2 原理图  2/6
- RXD2_2
- TXD2_2
- www.STCAI.com
- 2024-8-29
- 电源输入电路
- TXD_2
- 接主控芯片的串口1
- RXD_2
- 接主控芯片的串口2
- USB
  转双串口
- RXD2_2
- TXD2_2
- 推挽输出
- 高阻输入
- RXD2
- TXD
- 推挽输出
- 高阻输入
- RXD_2
- TXD_2
- 串口2通讯指示灯
- TXD2
- RXD
- RED
- RED
- D+
- 板上双串口TTL电平通讯
- D-
- SM3X6
- 不做双串口实验时要拨动 S2 使串口两边断开
  否则两对IO之间很可能互相干扰
- RXD2_2
- TXD_2
- MSS22D18
- test & normal not fited
- 做低功耗实验时，当MCU主时钟停振，
  功耗<1uA,去耦电容的电不能及时放光。
  即使断开后备电池，关闭主电源，
  短时间内系统上的电压还是正常的，低功耗啊 ！
  为方便做低功耗模式实验时，更改程序，
  需增加一个放电电阻，
  拨动开关拨到电池这边，断开后备电池，放电电阻导通；
  拨动开关拨到另外一边，接通电池，放电电阻断开
- TXD2_2
- RXD_2
- V1.2.2版本改动主要部分：
- P-MOS管
- 从电脑取5V电
- MSS22D18
- RXD2_2
- RED
- ↙若可以，选10nF
- 放电电阻
- 3V
- TXD2_2
- 按下断电，松开上电
- USB供电及USB直接下载程序(S1开关拨在电池不供电那端)
  因为走的是USB-HID通信协议，不需要安装任何驱动，直接USB下载。
  现在STC带硬件USB的MCU支持用自带的硬件USB直接下载用户程序和仿真
- 下载方法一，停电/上电下载，USB-ISP下载步骤，
  在【D-/P30,D+/P31】与 PC-USB 端口连接好的情况下：
  1、按下板子上的P32对应的按键。
  2、按下 Power-SW 按键，停电；接着松开 Power-SW 按键上电，进入ISP模式；
  等待STC-ISP下载软件，自动识别出 STC-USB Writer HID1”后，
  就与 P32 状态无关了，这时就可松开 P32按键。
  3、点击电脑下载软件中的下载编程按钮
  下载成功!
  注意与串口下载的操作顺序不同
- 下载方法二，复位下载，USB-ISP下载步骤，
  在【D-/P30,D+/P31】与 PC-USB 端口连接好的情况下：
  1、按下板子上的 P32 对应的 按键。
  2、按下 外部低电平手动复位按键，复位；接着松开复位按键，进入ISP模式；
  等待STC-ISP下载软件，自动识别出 STC-USB Writer HID1”后，
  就与 P32 状态无关了，这时就可松开 P32按键。
  3、点击电脑下载软件中的下载编程按钮
  下载成功!
  注意与串口下载的操作顺序不同
  备注:从用户区软复位到系统区也可以进入下载模式，实现全自动无手动不停电下载
- STC-USB Link1D接口
